# Altium schematic sheet Main.SchDoc
size A4
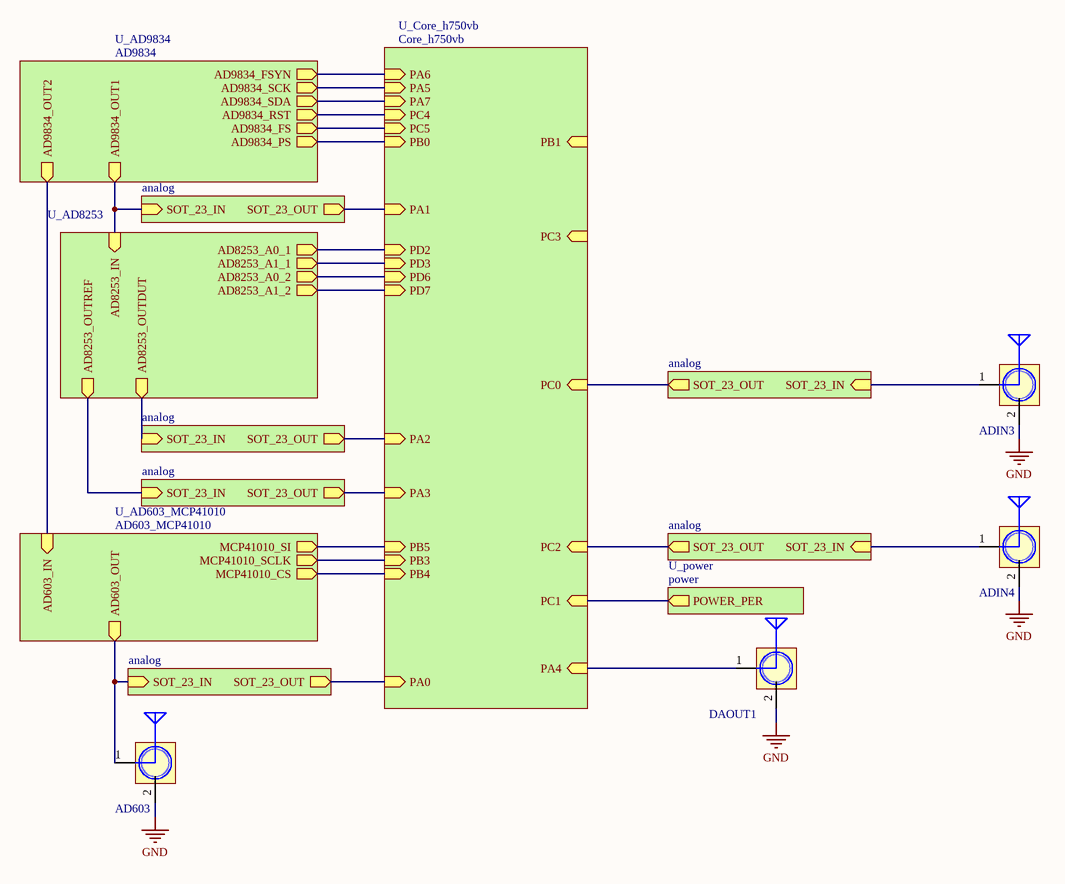
[diagram p0: Main.SchDoc]

## Parts
AD603  SMA WIFI 天线接口  [SMA]  (value not drawn)
ADIN3  SMA WIFI 天线接口  [SMA]  (value not drawn)
ADIN4  SMA WIFI 天线接口  [SMA]  (value not drawn)
DAOUT1  SMA WIFI 天线接口  [SMA]  (value not drawn)

## Sub-sheets
U_AD603_MCP41010 = AD603_MCP41010: AD603_OUT (out), MCP41010_SI (out), MCP41010_SCLK (out), MCP41010_CS (out), AD603_IN (in)
U_AD8253 = AD8253: AD8253_A0_1 (out), AD8253_A1_1 (out), AD8253_A0_2 (out), AD8253_A1_2 (out), AD8253_OUTDUT (out), AD8253_OUTREF (out), AD8253_IN (in)
U_AD9834 = AD9834: AD9834_FSYN (out), AD9834_SCK (out), AD9834_SDA (out), AD9834_RST (out), AD9834_FS (out), AD9834_PS (out), AD9834_OUT1 (out), AD9834_OUT2 (out)
U_Core_h750vb = Core_h750vb: PA6 (in), PA5 (in), PA7 (in), PC4 (in), PC5 (in), PB0 (in), PB5 (in), PB3 (in), PD2 (in), PD3 (in), PD6 (in), PD7 (in), PA1 (in), PA2 (in), PA3 (in), PC0 (in), PC1 (in), PC2 (in), PC3 (in), PA0 (in), PB1 (in), PB4 (in), PA4 (in)
U_power = power: POWER_PER (out)
? = analog: SOT_23_OUT (out), SOT_23_IN (in)
? = analog: SOT_23_OUT (out), SOT_23_IN (in)
? = analog: SOT_23_IN (in), SOT_23_OUT (out)
? = analog: SOT_23_IN (in), SOT_23_OUT (out)
? = analog: SOT_23_IN (in), SOT_23_OUT (out)
? = analog: SOT_23_IN (in), SOT_23_OUT (out)

## Nets
GND: AD603.2 ADIN3.2 ADIN4.2 DAOUT1.2
NetAD603_1: AD603.1(SINGLE) ; sheet U_AD603_MCP41010/AD603_OUT, sheet /SOT_23_IN
NetADIN3_1: ADIN3.1(SINGLE) ; sheet /SOT_23_IN
NetADIN4_1: ADIN4.1(SINGLE) ; sheet /SOT_23_IN
NetDAOUT1_1: DAOUT1.1(SINGLE) ; sheet U_Core_h750vb/PA4
(unnamed): sheet U_AD603_MCP41010/MCP41010_SI, sheet U_Core_h750vb/PB5
(unnamed): sheet U_AD603_MCP41010/MCP41010_SCLK, sheet U_Core_h750vb/PB3
(unnamed): sheet U_AD603_MCP41010/MCP41010_CS, sheet U_Core_h750vb/PB4
(unnamed): sheet U_AD603_MCP41010/AD603_IN, sheet U_AD9834/AD9834_OUT2
(unnamed): sheet U_AD8253/AD8253_A0_1, sheet U_Core_h750vb/PD2
(unnamed): sheet U_AD8253/AD8253_A1_1, sheet U_Core_h750vb/PD3
(unnamed): sheet U_AD8253/AD8253_A0_2, sheet U_Core_h750vb/PD6
(unnamed): sheet U_AD8253/AD8253_A1_2, sheet U_Core_h750vb/PD7
(unnamed): sheet U_AD8253/AD8253_OUTDUT, sheet /SOT_23_IN
(unnamed): sheet U_AD8253/AD8253_OUTREF, sheet /SOT_23_IN
(unnamed): sheet U_AD8253/AD8253_IN, sheet U_AD9834/AD9834_OUT1, sheet /SOT_23_IN
(unnamed): sheet U_AD9834/AD9834_FSYN, sheet U_Core_h750vb/PA6
(unnamed): sheet U_AD9834/AD9834_SCK, sheet U_Core_h750vb/PA5
(unnamed): sheet U_AD9834/AD9834_SDA, sheet U_Core_h750vb/PA7
(unnamed): sheet U_AD9834/AD9834_RST, sheet U_Core_h750vb/PC4
(unnamed): sheet U_AD9834/AD9834_FS, sheet U_Core_h750vb/PC5
(unnamed): sheet U_AD9834/AD9834_PS, sheet U_Core_h750vb/PB0
(unnamed): sheet /SOT_23_OUT, sheet U_Core_h750vb/PC2
(unnamed): sheet U_Core_h750vb/PA1, sheet /SOT_23_OUT
(unnamed): sheet U_Core_h750vb/PA2, sheet /SOT_23_OUT
(unnamed): sheet U_Core_h750vb/PA3, sheet /SOT_23_OUT
(unnamed): sheet U_Core_h750vb/PC0, sheet /SOT_23_OUT
(unnamed): sheet U_Core_h750vb/PC1, sheet U_power/POWER_PER
(unnamed): sheet U_Core_h750vb/PA0, sheet /SOT_23_OUT

## Library data of the parts
AD603 ADIN3 ADIN4 DAOUT1 = PORT_SMA: SMA-2.4G射频天线接口; 版权归属: 源创客; BOM名称: SMA-2.4G射频天线接口; 学习资源: www.ooocke.com